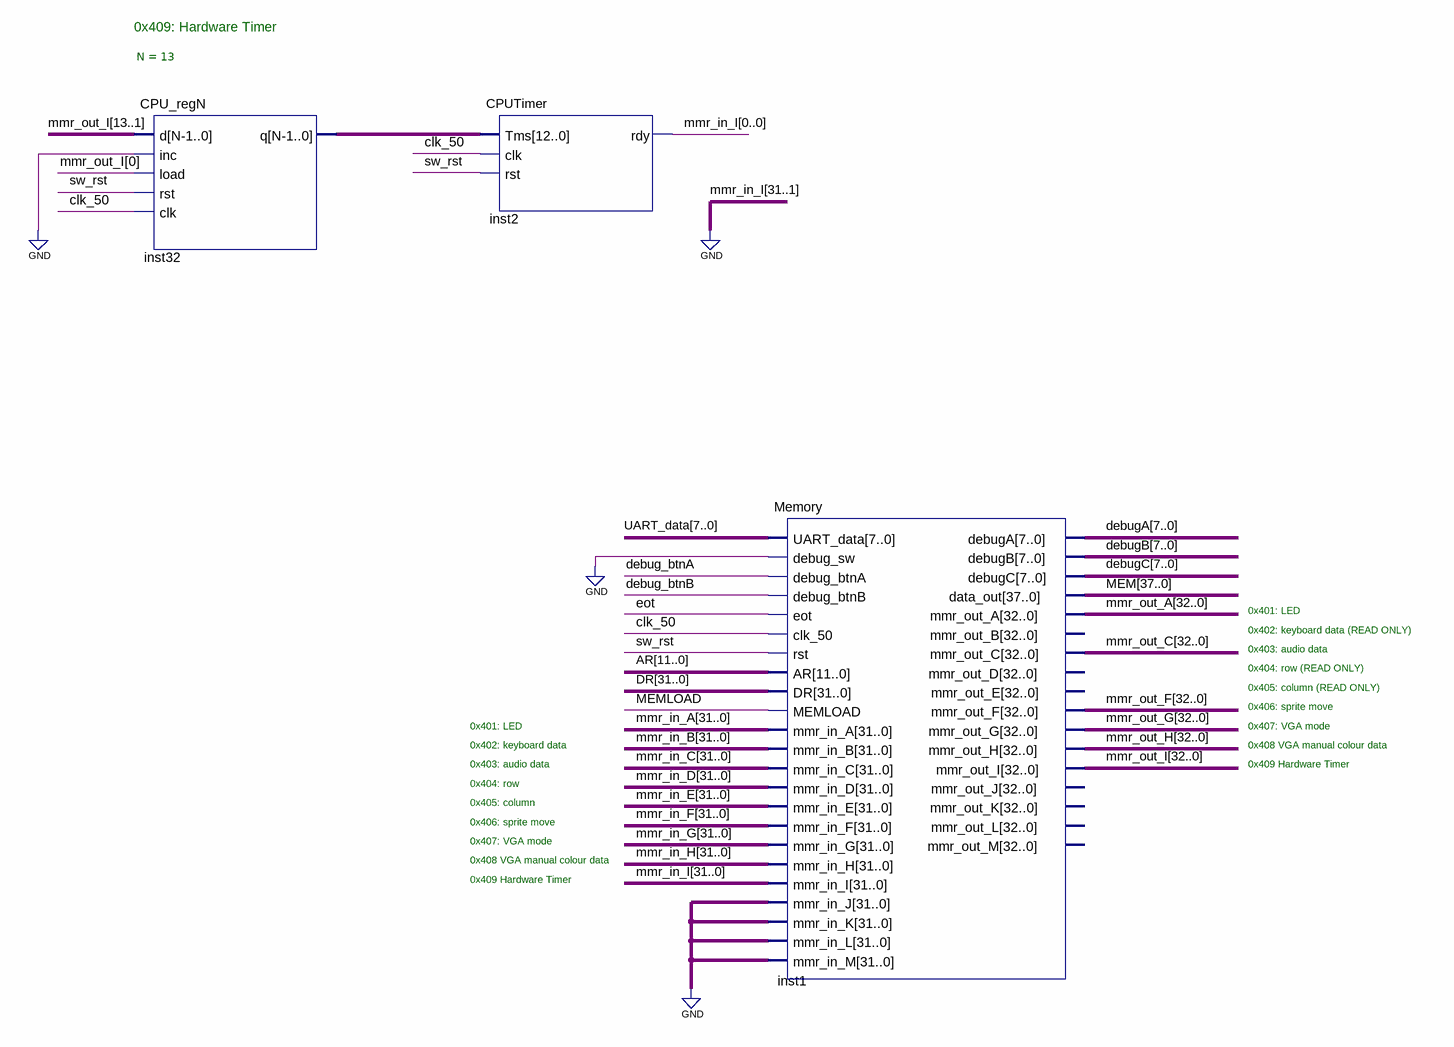
[diagram p0: schematic sheet]
// Quartus schematic temp.bdf as structural Verilog: 3 symbols, 0 pins
module temp (
);

  wire clk_50, debug_btnA, debug_btnB, eot, MEMLOAD, sw_rst;
  wire [0:0] mmr_in_I;
  wire [7:0] debugA, debugB, debugC, UART_data;
  wire [11:0] AR;
  wire [12:0] inst32_q;
  wire [31:0] DR, mmr_in_A, mmr_in_B, mmr_in_C, mmr_in_D, mmr_in_E, mmr_in_F, mmr_in_G, mmr_in_H;
  wire [32:0] mmr_out_A, mmr_out_C, mmr_out_F, mmr_out_G, mmr_out_H, mmr_out_I;
  wire [37:0] MEM;

  CPU_regN #(.N(13)) inst32 (
    .d(mmr_out_I[13:1]), .inc(1'b0), .load(mmr_out_I[0]), .rst(sw_rst), .clk(clk_50), .q(inst32_q));
  CPUTimer inst2 (.Tms(inst32_q), .clk(clk_50), .rst(sw_rst), .rdy(mmr_in_I[0]));
  Memory inst1 (
    .clk_50(clk_50), .UART_data(UART_data), .rst(sw_rst), .AR(AR), .DR(DR), .eot(eot), .MEMLOAD(MEMLOAD),
    .debug_sw(1'b0), .debug_btnA(debug_btnA), .debug_btnB(debug_btnB), .mmr_in_A(mmr_in_A),
    .mmr_in_B(mmr_in_B), .mmr_in_C(mmr_in_C), .mmr_in_D(mmr_in_D), .mmr_in_E(mmr_in_E), .mmr_in_F(mmr_in_F),
    .mmr_in_G(mmr_in_G), .mmr_in_H(mmr_in_H), .mmr_in_I({{31{1'b0}}, mmr_in_I[0]}), .mmr_in_J({32{1'b0}}),
    .mmr_in_K({32{1'b0}}), .mmr_in_L({32{1'b0}}), .mmr_in_M({32{1'b0}}), .debugA(debugA), .debugB(debugB),
    .debugC(debugC), .mmr_out_A(mmr_out_A), .data_out(MEM), .mmr_out_C(mmr_out_C), .mmr_out_F(mmr_out_F),
    .mmr_out_G(mmr_out_G), .mmr_out_H(mmr_out_H), .mmr_out_I(mmr_out_I));  // open: mmr_out_B, mmr_out_D, mmr_out_E, mmr_out_J, mmr_out_K, mmr_out_L, mmr_out_M

  // Notes on the sheet:
  //   0x409: Hardware Timer
  //   0x401: LED
  //   0x402: keyboard data (READ ONLY)
  //   0x403: audio data
  //   0x404: row (READ ONLY)
  //   0x405: column (READ ONLY)
  //   0x406: sprite move
  //   0x401: LED
  //   0x407: VGA mode
  //   0x402: keyboard data
  //   0x408 VGA manual colour data
  //   0x403: audio data
  //   0x409 Hardware Timer
  //   0x404: row
  //   0x405: column
  //   0x406: sprite move
  //   0x407: VGA mode
  //   0x408 VGA manual colour data
  //   0x409 Hardware Timer
endmodule
